# EAGLE design smartbedlight3 (EAGLE 6.5.0)
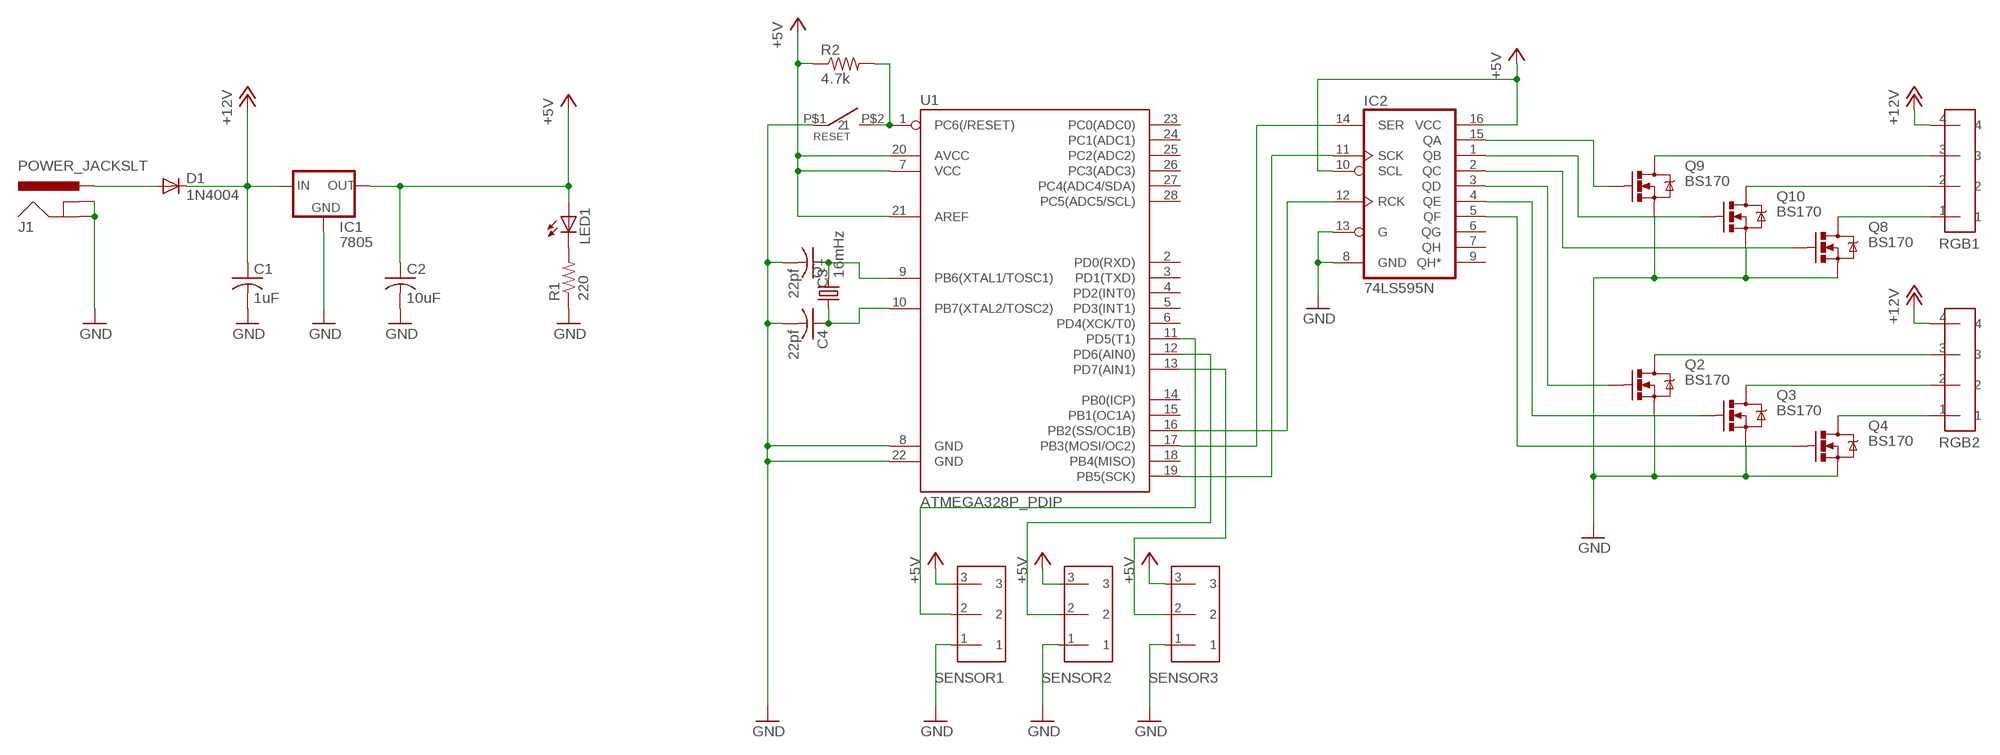
[diagram p0: schematic, sheet 1]

## Parts
C1  1uF  C-US025-030X050  [C025-030X050]
C2  10uF  C-US025-030X050  [C025-030X050]
C3  22pf  C-US025-025X050  [C025-025X050]
C4  22pf  C-US025-025X050  [C025-025X050]
D1  1N4004  [DO41-10]
IC1  7805  V_REG_78XXSIDE  [78XXL]
IC2  74LS595N  [DIL16]
J1  POWER_JACKSLT  [POWER_JACK_SLOT]
LED1  LED5MM  [LED5MM]
Q1  16mHz  CRYSTALHC49U-V  [HC49U-V]
Q2  BS170  MOSFET-NCHANNELBS170  [TO-92]
Q3  BS170  MOSFET-NCHANNELBS170  [TO-92]
Q4  BS170  MOSFET-NCHANNELBS170  [TO-92]
Q8  BS170  MOSFET-NCHANNELBS170  [TO-92]
Q9  BS170  MOSFET-NCHANNELBS170  [TO-92]
Q10  BS170  MOSFET-NCHANNELBS170  [TO-92]
R1  220  R-US_0204/7  [0204/7]
R2  4.7k  R-US_0207/10  [0207/10]
RESET  TACK_SWITCH  [TACK_SWITCH]
RGB1  PINHEAD4  [PINHEAD4]
RGB2  PINHEAD4  [PINHEAD4]
SENSOR1  PINHEAD3  [PINHEAD]
SENSOR2  PINHEAD3  [PINHEAD]
SENSOR3  PINHEAD3  [PINHEAD]
U1  ATMEGA328P_PDIP  [DIL28-3]

## Nets
+5V: C2.1 IC1.OUT IC2.10(SCL) IC2.16(VCC) LED1.A R2.1 SENSOR1.3 SENSOR2.3 SENSOR3.3 U1.7(VCC) U1.20(AVCC) U1.21(AREF)
+12V: C1.1 D1.C IC1.IN RGB1.4 RGB2.4
GND: C1.2 C2.2 C3.2 C4.2 IC1.GND IC2.8(GND) IC2.13(G) J1.GND@1(GNDBREAK) J1.GND@2(GND) Q2.3(S) Q3.3(S) Q4.3(S) Q8.3(S) Q9.3(S) Q10.3(S) R1.1 RESET.P$1 SENSOR1.1 SENSOR2.1 SENSOR3.1 U1.8(GND) U1.22(GND)
N$1: LED1.K(C) R1.2
N$2: D1.A J1.PWR
N$3: R2.2 RESET.P$2 U1.1(PC6(/RESET))
N$4: IC2.15(QA) Q9.2(G)
N$5: C4.1 Q1.1 U1.10(PB7(XTAL2/TOSC2))
N$6: IC2.12(RCK) U1.16(PB2(SS/OC1B))
N$7: SENSOR2.2 U1.12(PD6(AIN0))
N$8: Q9.1(D) RGB1.3
N$9: SENSOR1.2 U1.11(PD5(T1))
N$10: SENSOR3.2 U1.13(PD7(AIN1))
N$11: IC2.2(QC) Q8.2(G)
N$12: IC2.14(SER) U1.17(PB3(MOSI/OC2))
N$13: IC2.3(QD) Q2.2(G)
N$14: IC2.5(QF) Q4.2(G)
N$15: IC2.4(QE) Q3.2(G)
N$16: Q10.1(D) RGB1.2
N$17: IC2.1(QB) Q10.2(G)
N$18: IC2.11(SCK) U1.19(PB5(SCK))
N$19: Q8.1(D) RGB1.1
N$20: Q4.1(D) RGB2.1
N$21: Q2.1(D) RGB2.3
N$22: Q3.1(D) RGB2.2
N$28: C3.1 Q1.2 U1.9(PB6(XTAL1/TOSC1))
Unconnected: IC2.6(QG) IC2.7(QH) IC2.9(QH*) U1.2(PD0(RXD)) U1.3(PD1(TXD)) U1.4(PD2(INT0)) U1.5(PD3(INT1)) U1.6(PD4(XCK/T0)) U1.14(PB0(ICP)) U1.15(PB1(OC1A)) U1.18(PB4(MISO)) U1.23(PC0(ADC0)) U1.24(PC1(ADC1)) U1.25(PC2(ADC2)) U1.26(PC3(ADC3)) U1.27(PC4(ADC4/SDA)) U1.28(PC5(ADC5/SCL))

## Library data of the parts
C1 C2 = rcl:C-US: CAPACITOR, American symbol
C3 C4 = resistor:C-US: CAPACITOR, American symbol
D1 = diode:1N4004: DIODE general purpose rectifier, 1 A
IC1 = SparkFun-PowerIC:V_REG_78XX: Voltage Regulator Standard 7805 5V regulator. IGO (Input Ground Output). Spark Fun Electronics SKU : COM-00107
IC2 = SparkFun-DigitalIC:74*595: 8-bit SHIFT REGISTER, output latch
J1 = SparkFun:POWER_JACK: Power Jack This is the standard 5.5mm barrel jack for power. The PTH is the most common, proven, reliable, footprint. All others are experimental. The Slot footprint only works if the mill layer is transmitted to the PCB fab house so be warned. Spark Fun Electronics SKU : PRT-00119. Mating wall wart : TOL-00298 (and others)
LED1 = led:LED: LED OSRAM: - CHIPLED LG R971, LG N971, LY N971, LG Q971, LY Q971, LO R971, LY R971 LH N974, LH R974 LS Q976, LO Q976, LY Q976 LO Q996 - Hyper CHIPLED LW Q18S LB Q993, LB Q99A, LB R99A - SideLED LS A670, LO A670, LY A670, LG A670, LP A670 LB A673, LV A673, LT A673, LW A673 LH A674 LY A675 LS A676, LA A676, LO A676, LY A676, LW A676 LS A679, LY A679, LG A679 - Hyper Micro SIDELED® LS Y876, LA Y876, LO Y876, LY Y876 LT Y87S - SmartLED LW L88C, LW L88S LB L89C, LB L89S, LG L890 LS L89K, LO L89K, LY L89K LS L896, LA L896, LO L896, LY L896 - TOPLED LS T670, LO T670, LY T670, LG T670, LP T670 LSG T670, LSP T670, LSY T670, LOP T670, LYG T670 LG T671, LOG T671, LSG T671 LB T673, LV T673, LT T673, LW T673 LH T674 LS T676, LA T676, LO T676, LY T676, LB T676, LH T676, LSB T676, LW T676 LB T67C, LV T67C, LT T67C, LS T67K, LO T67K, LY T67K, LW E67C LS E67B, LA E67B, LO E67B, LY E67B, LB E67C, LV E67C, LT E67C LW T67C LS T679, LY T679, LG T679 LS T770, LO T770, LY T770, LG T770, LP T770 LB T773, LV T773, LT T773, LW T773 LH T774 LS E675, LA E675, LY E675, LS T675 LS T776, LA T776, LO T776, LY T776, LB T776 LHGB T686 LT T68C, LB T68C - Hyper Mini TOPLED® LB M676 - Mini TOPLED Santana® LG M470 LS M47K, LO M47K, LY M47K Source: http://www.osram.convergy.de LUXEON: - LUMILED® LXK2-PW12-R00, LXK2-PW12-S00, LXK2-PW14-U00, LXK2-PW14-V00 LXK2-PM12-R00, LXK2-PM12-S00, LXK2-PM14-U00 LXK2-PE12-Q00, LXK2-PE12-R00, LXK2-PE12-S00, LXK2-PE14-T00, LXK2-PE14-U00 LXK2-PB12-K00, LXK2-PB12-L00, LXK2-PB12-M00, LXK2-PB14-N00, LXK2-PB14-P00, LXK2-PB14-Q00 LXK2-PR12-L00, LXK2-PR12-M00, LXK2-PR14-Q00, LXK2-PR14-R00 LXK2-PD12-Q00, LXK2-PD12-R00, LXK2-PD12-S00 LXK2-PH12-R00, LXK2-PH12-S00 LXK2-PL12-P00, LXK2-PL12-Q00, LXK2-PL12-R00 Source: www.luxeon.com KINGBRIGHT: KA-3528ASYC Source: www.kingbright.com
Q1 = crystal:CRYSTAL: CRYSTAL; OC_FARNELL: 1666969; OC_NEWARK: unknown
Q2-Q4 Q8-Q10 = SparkFun-DiscreteSemi:MOSFET-NCHANNEL: Common NMOSFET Parts MFG P/N Store ID Prod ID FDD8780 TRANS-09984 SI7820DN TRANS-11055 FDS6630A IC-08089 2N7002PW TRANS-11151 FQP30N06L COM-10213 TRANS-10060 BSS123LT1G TRANS-08345 BSS138 TRANS-00830 BS170 2N7000
R1 = rcl:R-US_: RESISTOR, American symbol
R2 = resistor:R-US_: RESISTOR, American symbol
RESET = compass:TACK_SWITCH
RGB1 RGB2 = pinhead3.96:PINHEAD4
SENSOR1-SENSOR3 = pinhead3.96:PINHEAD3
U1 = SparkFun-DigitalIC:ATMEGA328P_PDIP: uC used in the Arduino 32kb flash, 1k EEPROM, 2k SRAM This is the through-hole version of this chip.

## Board
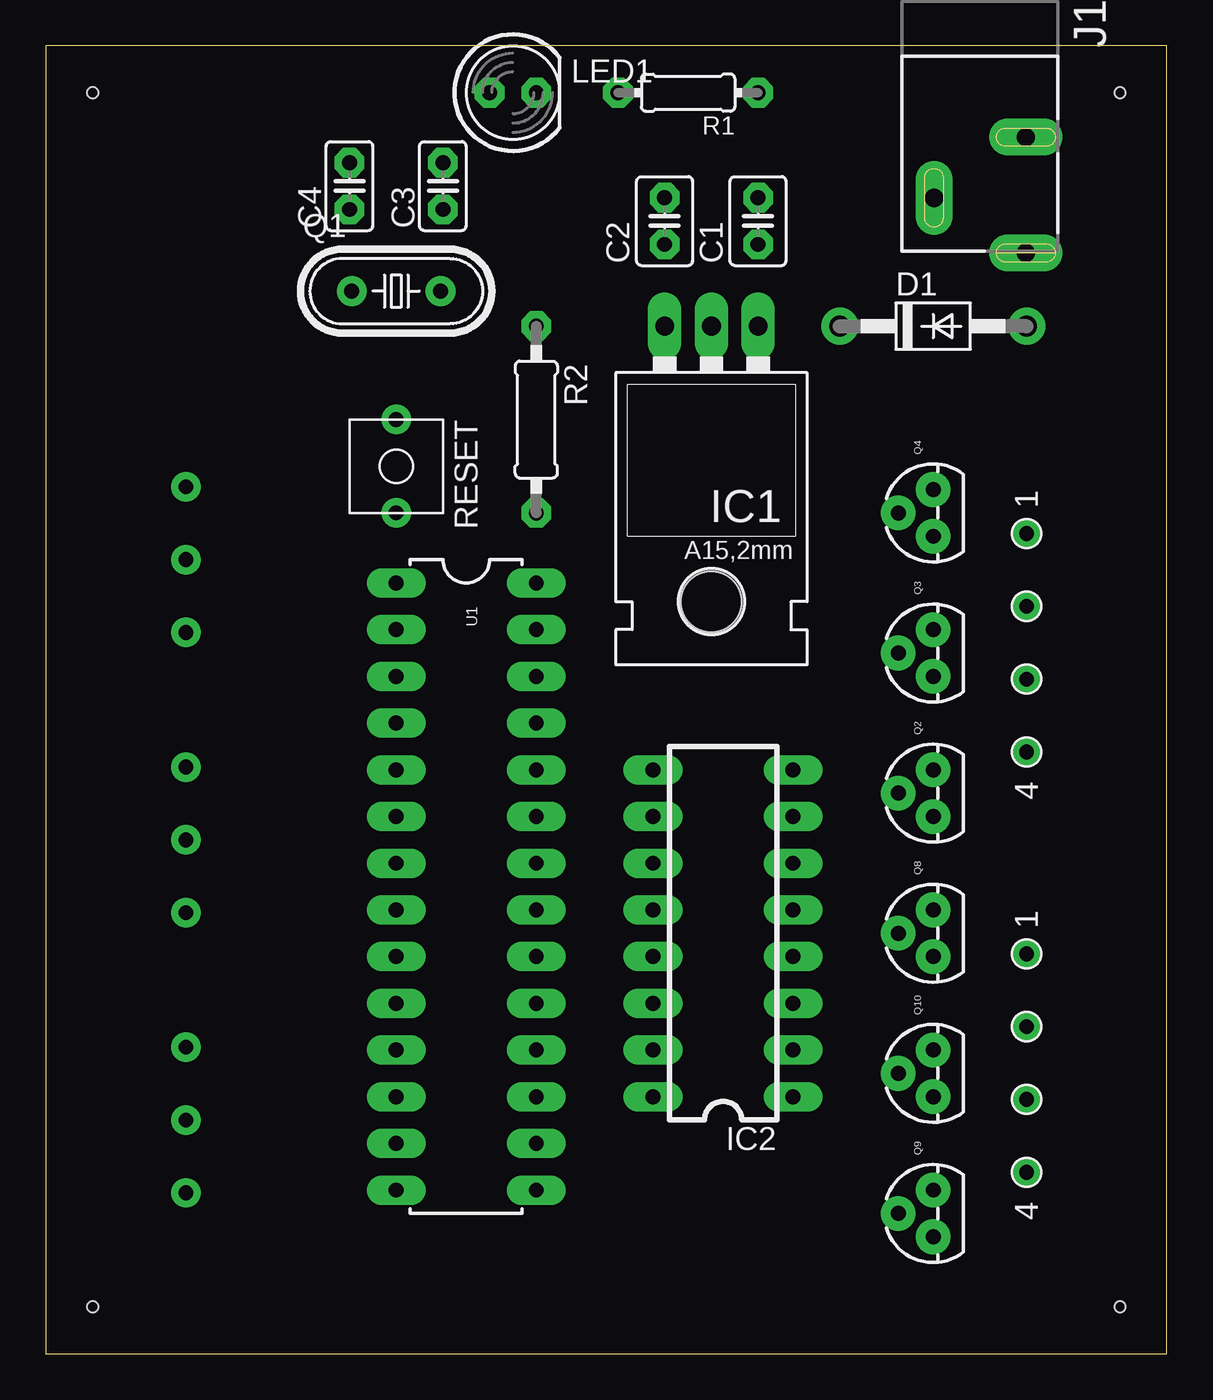
[diagram p1: board, top side]
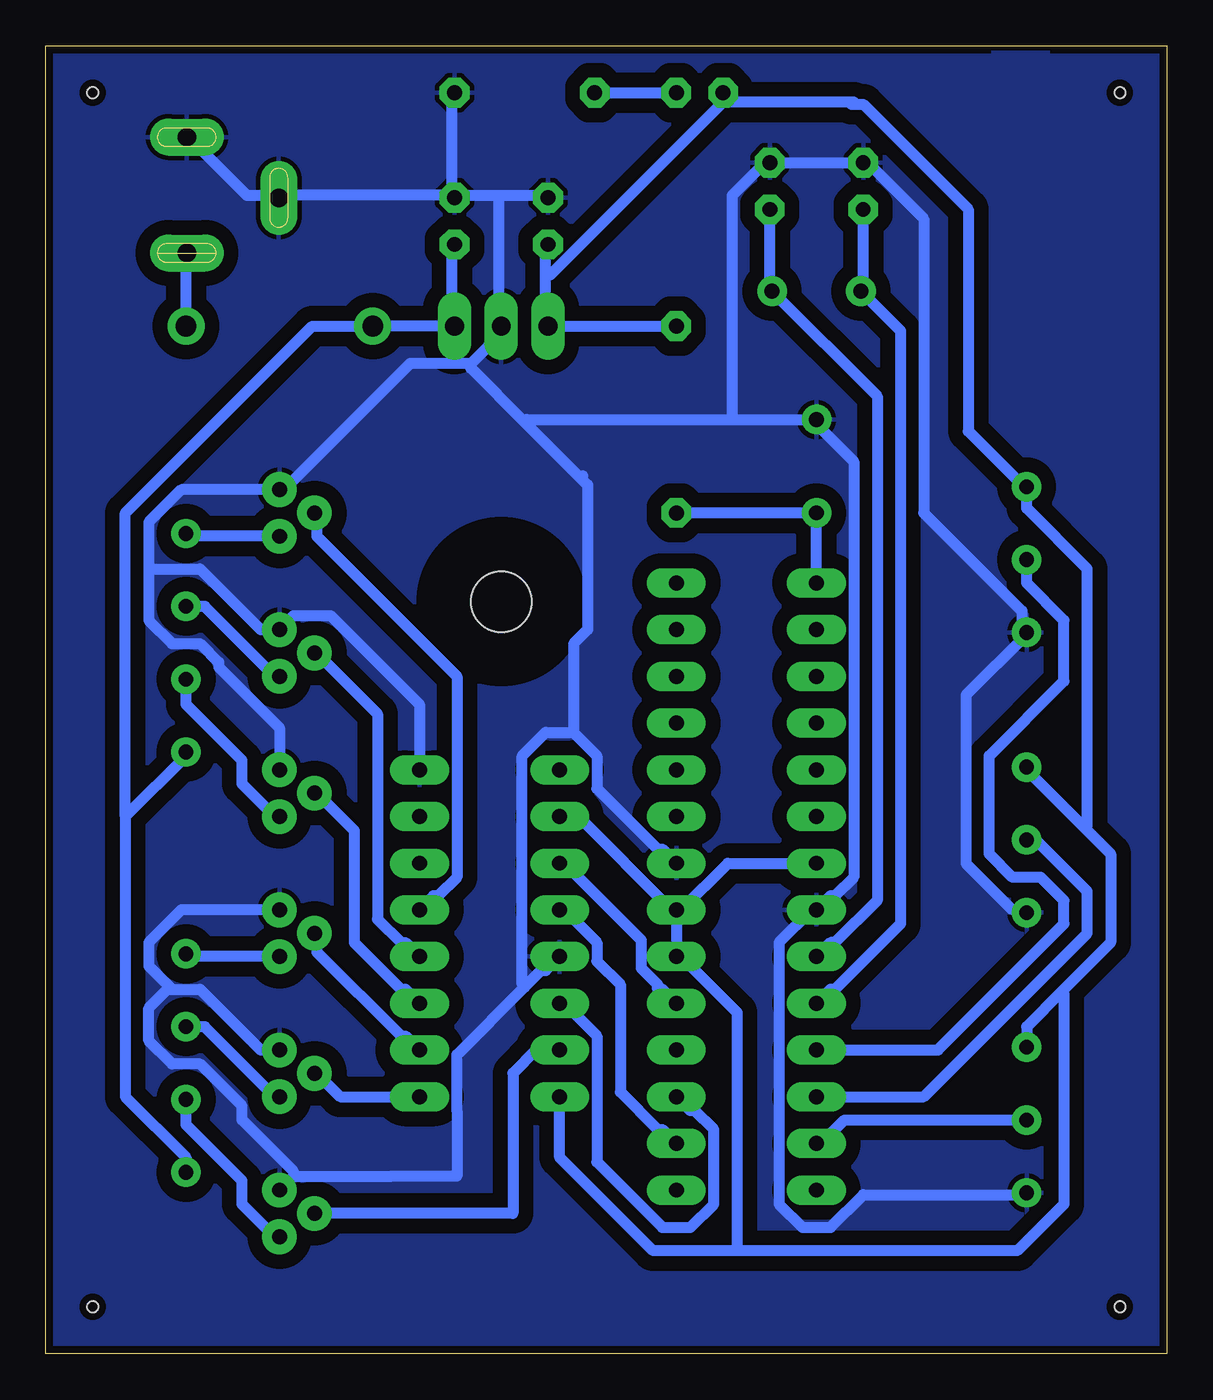
[diagram p2: board, bottom side, seen from below]

Size 60.96 x 71.12 mm. Coordinates in mm from the lower left corner, seen from the top.
Outline: 0,0 60.96,0 60.96,71.12 0,71.12 0,0
Copper layers (1*16): Top 0.035mm / dielectric 1.5mm / Bottom 0.035mm
Design rules "hobby": minimum track width 0.8mm, minimum drill 0.8mm, track to track 0.8mm, track to pad 0.8mm, pad to pad 0.45mm, via to via 0.8mm, smd to smd 8mil, copper to edge 10mil, drill to drill 8mil, minimum pad ring 0.4mm, minimum via ring 0.6mm, stop-mask expansion 0mil, vias tented up to drill 0mil, thermal gap 10mil
Holes 0.6 mm at 2.54,68.58 2.54,2.54 58.42,2.54 58.42,68.58

### Footprints (pad centres in the part's own frame; a part is rotated, then mirrored left to right if it is on the bottom)
C025-030X050 = drill 0.813 octagon: 1 -1.27,0; 2 1.27,0
C025-025X050 = drill 0.813 octagon: 1 -1.27,0; 2 1.27,0
DO41-10 = drill 1.118: A 5.08,0; C -5.08,0
78XXL = drill 1.016 long: GND 0,-3.81; IN -2.54,-3.81; OUT 2.54,-3.81 | hole 3.302: 0,11.176
DIL16 = drill 0.813 long: 1 -8.89,-3.81; 2 -6.35,-3.81; 3 -3.81,-3.81; 4 -1.27,-3.81; 5 1.27,-3.81; 6 3.81,-3.81; 7 6.35,-3.81; 8 8.89,-3.81; 9 8.89,3.81; 10 6.35,3.81; 11 3.81,3.81; 12 1.27,3.81; 13 -1.27,3.81; 14 -3.81,3.81; 15 -6.35,3.81; 16 -8.89,3.81
POWER_JACK_SLOT = drill 1 pad 2 long: GND@1 2.58,7.5; GND@2 7.58,10.8; PWR 2.58,13.8
LED5MM = drill 0.813 octagon: A -1.27,0; K 1.27,0
HC49U-V = drill 0.813: 1 -2.413,0; 2 2.413,0
TO-92 = drill 0.813 pad 1.88: 1 -1.27,0; 2 0,1.905; 3 1.27,0
0204/7 = drill 0.813 octagon: 1 -3.81,0; 2 3.81,0
0207/10 = drill 0.813 octagon: 1 -5.08,0; 2 5.08,0
TACK_SWITCH = drill 0.8: P$1 -2.54,0; P$2 2.54,0
PINHEAD4 = drill 0.8: 1 -3.96,0; 2 0,0; 3 3.96,0; 4 7.92,0
PINHEAD = drill 0.8: 1 -3.96,0; 2 0,0; 3 3.96,0
DIL28-3 = drill 0.813 long: 1 -16.51,-3.81; 2 -13.97,-3.81; 3 -11.43,-3.81; 4 -8.89,-3.81; 5 -6.35,-3.81; 6 -3.81,-3.81; 7 -1.27,-3.81; 8 1.27,-3.81; 9 3.81,-3.81; 10 6.35,-3.81; 11 8.89,-3.81; 12 11.43,-3.81; 13 13.97,-3.81; 14 16.51,-3.81; 15 16.51,3.81; 16 13.97,3.81; 17 11.43,3.81; 18 8.89,3.81; 19 6.35,3.81; 20 3.81,3.81; 21 1.27,3.81; 22 -1.27,3.81; 23 -3.81,3.81; 24 -6.35,3.81; 25 -8.89,3.81; 26 -11.43,3.81; 27 -13.97,3.81; 28 -16.51,3.81

### Placement (x,y rotation side)
C1  38.73,61.59 90 top
C2  33.66,61.59 90 top
C3  21.59,63.5 90 top
C4  16.51,63.5 90 top
D1  48.26,55.88 0 top
IC1  36.2,52.07 180 top
IC2  36.83,22.86 90 top
J1  55.88,73.66 180 top
LED1  25.4,68.58 0 top
Q1  19.05,57.78 0 top
Q2  48.26,30.48 90 top
Q3  48.26,38.1 90 top
Q4  48.26,45.72 90 top
Q8  48.26,22.86 90 top
Q9  48.26,7.62 90 top
Q10  48.26,15.24 90 top
R1  34.93,68.58 180 top
R2  26.67,50.8 270 top
RESET  19.05,48.26 270 top
RGB1  53.34,17.78 270 top
RGB2  53.34,40.64 270 top
SENSOR1  7.62,43.18 90 top
SENSOR2  7.62,27.94 90 top
SENSOR3  7.62,12.7 90 top
U1  22.86,25.4 270 top

### Tracks (layer width: path | path; a pad name or v marks a point on that pad's centre or on a via)
+5V
  Bottom 0.6: IC2.10 32,29.21 26.92,24.13 U1.21 | 33.78,58.67 33.78,56.13 IC1.OUT R2.1 | 33.78,58.67 33.78,60.2 C2.1 | 33.78,58.67 33.53,58.67 24.13,68.07 LED1.A 23.88,68.07 17.27,68.07 | U1.21 U1.20 26.42,21.59 23.37,18.54 23.37,7.62 | IC2.16 33.02,10.67 27.94,5.59 25.4,5.59 | U1.7 23.88,26.67 26.42,24.13 U1.21 | SENSOR3.3 7.62,17.78 5.71,19.68 | 5.71,19.68 3.05,22.35 3.05,27.18 4.45,28.57 | 4.45,28.57 7.62,31.75 SENSOR2.3 | 4.45,28.57 4.32,28.7 4.32,42.67 7.62,45.97 7.62,46.99 SENSOR1.3 7.87,47.24 | 17.02,68.07 17.27,68.07 | 20.32,5.59 8.13,5.59 5.59,8.13 5.59,19.56 5.71,19.68 | 17.27,68.07 17.15,67.94
  Bottom 0.61: 17.15,67.94 16.51,67.94 10.79,62.23 10.79,50.17 7.62,46.99 | 20.32,5.59 23.37,5.59 | 23.37,5.59 25.4,5.59 | 23.37,7.62 23.37,5.59
+12V
  Bottom 0.6: C1.1 38.86,60.2 38.86,55.88 IC1.IN D1.C 46.48,55.88 56.64,45.72 56.64,29.21 | RGB1.4 53.34,10.67 56.64,13.97 56.64,29.21 | 56.64,29.21 53.34,32.51 RGB2.4
GND
  Bottom 0.6: Q10.3 49.28,16.51 52.58,19.81 54.1,19.81 | 54.1,19.81 55.37,21.08 55.37,22.35 53.59,24.13 Q8.3 | IC2.13 33.78,20.83 34.04,20.83 34.93,19.94 | 34.93,19.94 38.61,16.26 38.61,13.21 | 47.5,9.65 42.16,9.65 | Q9.3 47.5,9.65 | U1.22 27.43,27.43 27.69,27.43 30.99,30.73 30.99,32.51 32.26,33.78 | 32.26,33.78 33.78,33.78 35.05,32.51 35.05,20.07 34.93,19.94 | 54.1,19.81 54.36,19.81 55.37,18.8 55.37,17.02 54.1,15.75 52.58,15.75 50.29,13.46 50.29,12.7 47.5,9.91 47.5,9.65 | IC2.8 40.64,35.31 45.47,40.13 47.5,40.13 Q3.3 49.28,39.37 52.58,42.67 55.37,42.67 | Q2.3 48.26,34.04 51.56,37.34 51.56,37.59 52.58,38.61 54.1,38.61 55.37,39.88 55.37,42.67 | 55.37,42.67 55.37,45.21 53.59,46.99 Q4.3 48.01,46.99 41.15,53.85 37.85,53.85 | J1.GND@1 53.09,66.04 50.04,62.99 48.51,62.99 J1.GND@2 48.26,62.99 38.86,62.99 C1.2 | 37.85,53.85 36.07,55.63 IC1.GND 36.32,56.13 36.32,62.99 | 32.26,33.78 32.26,38.61 31.5,39.37 31.5,47.24 31.88,47.62 | 34.93,50.67 37.85,53.59 37.85,53.85 | 34.93,50.67 31.88,47.62 | 36.32,62.99 38.61,62.99 C1.2 | 36.32,62.99 33.78,62.99 C2.2 | R1.1 38.86,68.58 38.86,63.25 C1.2 | 31.75,47.75 31.88,47.62 | 23.62,50.8 34.8,50.8 34.93,50.67 | 23.62,50.8 RESET.P$1 19.05,50.55 17.02,48.51 17.02,25.91 18.03,24.89 18.29,24.89 U1.8 19.3,24.13 21.08,22.35 21.08,8.13 19.81,6.86 18.29,6.86 16.51,8.64 7.62,8.64 SENSOR3.1 | 23.62,50.8 23.62,62.99 21.84,64.77 C3.2 C4.2 16.26,64.77 13.21,61.72 13.21,45.72 7.87,40.39 7.87,39.37 SENSOR1.1 7.62,39.12 10.92,35.81 10.92,26.67 8.38,24.13 7.62,24.13 SENSOR2.1
  Bottom 0.61: 38.61,13.21 38.61,9.65 42.16,9.65
  pour Bottom (isolate 0.406): 0,71.12 0,0 60.96,0 60.96,71.12
N$1
  Bottom 0.6: R1.2 LED1.K
N$2
  Bottom 0.6: D1.A 53.34,59.69 J1.PWR
N$3
  Bottom 0.6: U1.1 RESET.P$2 R2.2
N$4
  Bottom 0.61: IC2.15 34.29,16.51 35.56,15.24 35.56,7.62 Q9.2
N$5
  Bottom 0.6: U1.10 18.29,19.81 18.03,19.81 14.48,23.37 14.48,55.63 Q1.1 16.51,57.91 C4.1
N$6
  Bottom 0.6: U1.16 27.43,12.19 27.69,12.19 29.72,14.22 29.72,20.07 30.99,21.34 30.99,22.35 32.77,24.13 IC2.12
N$7
  Bottom 0.6: SENSOR2.2 7.11,27.94 4.32,25.15 4.32,22.86 13.21,13.97 U1.12
N$8
  Bottom 0.6: RGB1.3 53.34,12.45 50.29,9.4 50.29,8.13 48.51,6.35 Q9.1
N$9
  Bottom 0.6: SENSOR1.2 7.62,41.91 5.59,39.88 5.59,36.58 9.65,32.51 9.65,27.18 8.38,25.91 6.86,25.91 5.59,24.64 5.59,23.37 12.45,16.51 U1.11
N$10
  Bottom 0.6: SENSOR3.2 17.53,12.7 18.8,11.43 U1.13
N$11
  Bottom 0.6: IC2.2 41.4,17.27 41.66,17.27 46.23,21.84 46.23,22.86 Q8.2
N$12
  Bottom 0.6: U1.17 25.91,13.21 25.65,13.21 24.64,12.19 24.64,8.13 25.91,6.86 27.43,6.86 30.99,10.41 30.99,17.27 32.77,19.05 IC2.14
N$13
  Bottom 0.6: IC2.3 41.4,19.81 41.66,19.81 44.2,22.35 44.2,28.45 46.23,30.48 Q2.2
N$14
  Bottom 0.6: IC2.5 39.88,24.89 39.62,24.89 38.61,25.91 38.61,36.83 46.23,44.45 46.23,45.72 Q4.2
N$15
  Bottom 0.6: IC2.4 41.4,22.35 41.66,22.35 42.93,23.62 42.93,34.8 46.23,38.1 Q3.2
N$16
  Bottom 0.6: RGB1.2 52.32,17.78 48.51,13.97 Q10.1
N$17
  Bottom 0.6: IC2.1 44.96,13.97 46.23,15.24 Q10.2
N$18
  Bottom 0.6: U1.19 27.43,19.81 27.69,19.81 | 29.72,23.62 32.77,26.67 IC2.11
  Bottom 0.61: 27.69,19.81 27.69,20.07 28.58,20.96 28.58,22.48 29.72,23.62
N$19
  Bottom 0.6: Q8.1 53.34,21.59 RGB1.1
N$20
  Bottom 0.6: Q4.1 53.34,44.45 RGB2.1
N$21
  Bottom 0.6: RGB2.3 53.34,35.31 50.29,32.26 50.29,30.99 48.51,29.21 Q2.1
N$22
  Bottom 0.6: RGB2.2 52.32,40.64 48.51,36.83 Q3.1
N$23
  pour Bottom: 2.54,64.77 2.54,50.8 3.18,50.8 6.35,50.8 6.35,64.77
N$24
  pour Bottom: 6.35,50.8 9.53,50.8 9.53,71.12 6.35,71.12
N$28
  Bottom 0.6: U1.9 18.29,22.35 18.03,22.35 15.75,24.64 15.75,52.07 Q1.2 21.59,57.91 C3.1

### Text on the board
bRestrict: SBL v3 | By Compass